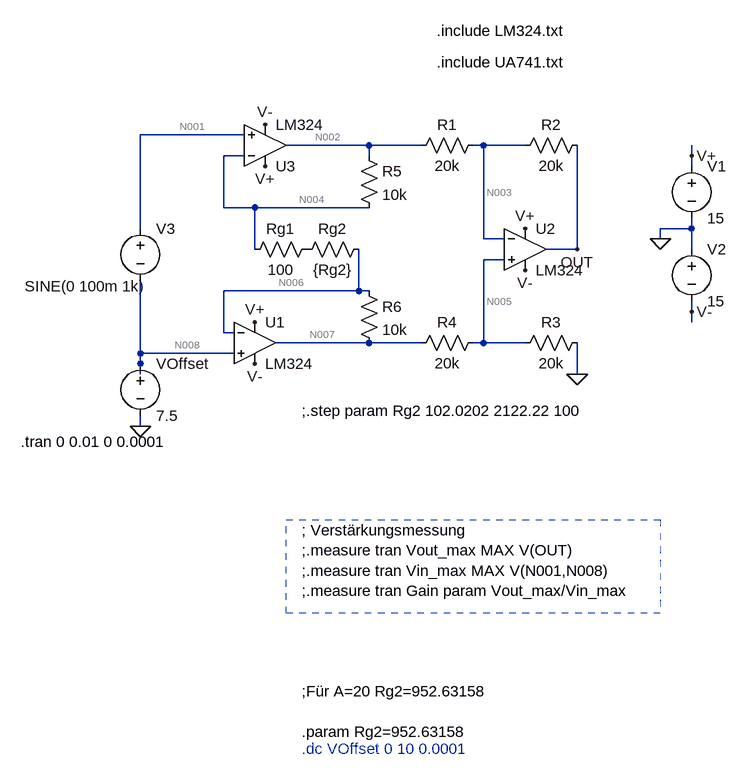
[diagram p0: schematic iamp.asc]
iamp.asc, the LTspice schematic file:
Version 4.1
SHEET 1 880 680
WIRE -240 -688 -400 -688
WIRE -48 -672 -176 -672
WIRE 32 -672 -48 -672
WIRE 128 -672 112 -672
WIRE 192 -672 128 -672
WIRE -240 -656 -272 -656
WIRE -48 -656 -48 -672
WIRE 448 -656 448 -672
WIRE 448 -640 448 -656
WIRE -272 -576 -272 -656
WIRE -224 -576 -272 -576
WIRE -48 -576 -224 -576
WIRE -400 -544 -400 -688
WIRE 448 -544 448 -560
WIRE 448 -544 400 -544
WIRE 128 -528 128 -672
WIRE 160 -528 128 -528
WIRE 400 -528 400 -544
WIRE -224 -512 -224 -576
WIRE 272 -512 272 -672
WIRE 272 -512 224 -512
WIRE 448 -512 448 -544
WIRE 160 -496 128 -496
WIRE -64 -448 -64 -512
WIRE -64 -448 -272 -448
WIRE -48 -448 -64 -448
WIRE 448 -416 448 -432
WIRE 448 -400 448 -416
WIRE -272 -384 -272 -448
WIRE -256 -384 -272 -384
WIRE -48 -368 -192 -368
WIRE 32 -368 -48 -368
WIRE 128 -368 128 -496
WIRE 128 -368 112 -368
WIRE 192 -368 128 -368
WIRE -400 -352 -400 -464
WIRE -256 -352 -400 -352
WIRE -400 -336 -400 -352
WIRE -400 -320 -400 -336
WIRE 272 -320 272 -368
WIRE -400 -240 -400 -256
FLAG 400 -528 0
FLAG 448 -656 V+
FLAG 448 -416 V-
FLAG 272 -512 OUT
FLAG 192 -544 V+
FLAG 192 -480 V-
FLAG 272 -320 0
FLAG -208 -640 V+
FLAG -224 -400 V+
FLAG -224 -336 V-
FLAG -208 -704 V-
FLAG -400 -240 0
SYMBOL voltage 448 -656 R0
WINDOW 123 0 0 Left 2
WINDOW 39 0 0 Left 2
SYMATTR InstName V1
SYMATTR Value 15
SYMBOL voltage 448 -528 R0
WINDOW 123 0 0 Left 2
WINDOW 39 0 0 Left 2
SYMATTR InstName V2
SYMATTR Value 15
SYMBOL Opamps\\opamp2 192 -576 R0
SYMATTR InstName U2
SYMATTR Value LM324
SYMBOL res 128 -688 R90
WINDOW 0 0 56 VBottom 2
WINDOW 3 32 56 VTop 2
SYMATTR InstName R1
SYMATTR Value 20k
SYMATTR SpiceLine tol=5
SYMBOL res 288 -688 R90
WINDOW 0 0 56 VBottom 2
WINDOW 3 32 56 VTop 2
SYMATTR InstName R2
SYMATTR Value 20k
SYMATTR SpiceLine tol=5
SYMBOL res 288 -384 R90
WINDOW 0 0 56 VBottom 2
WINDOW 3 32 56 VTop 2
SYMATTR InstName R3
SYMATTR Value 20k
SYMATTR SpiceLine tol=5
SYMBOL res 128 -384 R90
WINDOW 0 0 56 VBottom 2
WINDOW 3 32 56 VTop 2
SYMATTR InstName R4
SYMATTR Value 20k
SYMATTR SpiceLine tol=5
SYMBOL voltage -400 -560 R0
WINDOW 3 -178 105 Left 2
WINDOW 123 0 0 Left 2
WINDOW 39 0 0 Left 2
SYMATTR Value SINE(0 100m 1k)
SYMATTR InstName V3
SYMBOL voltage -400 -352 R0
WINDOW 123 0 0 Left 2
WINDOW 39 0 0 Left 2
SYMATTR InstName VOffset
SYMATTR Value 7.5
SYMBOL Opamps\\opamp2 -224 -432 R0
SYMATTR InstName U1
SYMATTR Value LM324
SYMBOL Opamps\\opamp2 -208 -608 M180
SYMATTR InstName U3
SYMATTR Value LM324
SYMBOL res -64 -672 R0
SYMATTR InstName R5
SYMATTR Value 10k
SYMATTR SpiceLine tol=5
SYMBOL res -64 -464 R0
SYMATTR InstName R6
SYMATTR Value 10k
SYMATTR SpiceLine tol=5
SYMBOL res -128 -528 R90
WINDOW 0 0 56 VBottom 2
WINDOW 3 32 56 VTop 2
SYMATTR InstName Rg1
SYMATTR Value 100
SYMBOL res -48 -528 R90
WINDOW 0 0 56 VBottom 2
WINDOW 3 32 56 VTop 2
SYMATTR InstName Rg2
SYMATTR Value {Rg2}
SYMATTR SpiceLine tol=5
TEXT 56 -800 Left 2 !.include UA741.txt
TEXT 56 -848 Left 2 !.include LM324.txt
TEXT -152 -264 Left 2 !;.step param Rg2 102.0202 2122.22 100
TEXT -584 -216 Left 2 !.tran 0 0.01 0 0.0001
TEXT -152 -80 Left 2 !; Verstärkungsmessung\n;.measure tran Vout_max MAX V(OUT)\n;.measure tran Vin_max MAX V(N001,N008)\n;.measure tran Gain param Vout_max/Vin_max
TEXT -152 256 Left 2 ;.dc VOffset 0 10 0.0001
TEXT -152 168 Left 2 !;Für A=20 Rg2=952.63158\n \n.param Rg2=952.63158
RECTANGLE Normal 400 48 -176 -96 2

The netlist it stands for:
* iamp.asc
V1 V+ 0 15
V2 0 V- 15
X§U2 N005 N003 V+ V- OUT LM324  ; pins In+ In- V+ V- OUT
R1 N003 N002 20k tol=5
R2 OUT N003 20k tol=5
R3 0 N005 20k tol=5
R4 N005 N007 20k tol=5
V3 N001 N008 SINE(0 100m 1k)
VOffset N008 0 7.5
X§U1 N008 N006 V+ V- N007 LM324  ; pins In+ In- V+ V- OUT
X§U3 N001 N004 V+ V- N002 LM324  ; pins In+ In- V+ V- OUT
R5 N002 N004 10k tol=5
R6 N006 N007 10k tol=5
Rg1 P001 N004 100
Rg2 N006 P001 {Rg2} tol=5
.include UA741.txt
.include LM324.txt
;.step param Rg2 102.0202 2122.22 100
.tran 0 0.01 0 0.0001
; Verstärkungsmessung
;.measure tran Vout_max MAX V(OUT)
;.measure tran Vin_max MAX V(N001,N008)
;.measure tran Gain param Vout_max/Vin_max
* .dc VOffset 0 10 0.0001
;Für A=20 Rg2=952.63158
.param Rg2=952.63158
.backanno
.end

* Results of the author's LTspice run, read from the files saved beside the schematic
* Operating Point, zero values left out:
*   V(v-) = -15 V
*   V(n003) = 3.75 V
*   V(out) = -497.8 µV
*   V(n007) = 7.499 V
*   V(n006) = 7.499 V
*   V(p001) = 7.499 V
*   V(v+) = 15 V
*   V(n005) = 3.75 V
*   V(n002) = 7.499 V
*   V(n001) = 7.5 V
*   V(n008) = 7.5 V
*   V(n004) = 7.499 V
*   I(V1) = -2.999 mA
*   I(R2) = -187.5 µA
*   I(R3) = -187.5 µA
*   I(R6) = 19.3 nA
*   I(V3) = 19.04 nA
*   I(R4) = -187.5 µA
*   I(VOffset) = 38.07 nA
*   I(R5) = -19.3 nA
*   I(V2) = -2.998 mA
*   I(R1) = -187.5 µA
*   Ix(u1:1) = -19.04 nA
*   Ix(u1:2) = -19.3 nA
*   Ix(u1:3) = 999.8 µA
*   Ix(u1:4) = -999.4 µA
*   Ix(u1:5) = -187.5 µA
*   Ix(u2:1) = -19.49 nA
*   Ix(u2:2) = -19.61 nA
*   Ix(u2:3) = 999.8 µA
*   Ix(u2:4) = -999.6 µA
*   Ix(u2:5) = 187.5 µA
*   Ix(u3:1) = -19.04 nA
*   Ix(u3:2) = -19.3 nA
*   Ix(u3:3) = 999.8 µA
*   Ix(u3:4) = -999.4 µA
*   Ix(u3:5) = -187.5 µA